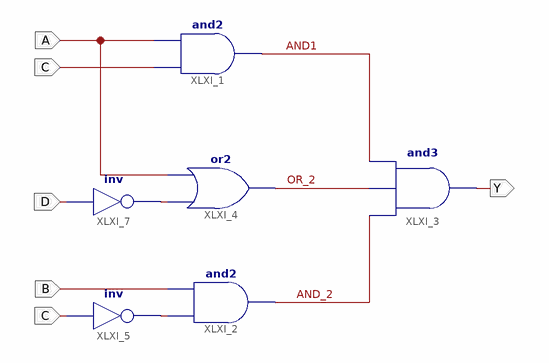
[diagram p0: schematic sheet 1]
// Xilinx ISE schematic scheme.sch (virtex5) as structural Verilog: 6 symbols, 5 ports
module scheme (
  input  A,
  input  C,
  input  B,
  input  D,
  output Y
);

  wire AND1, AND_2, OR_2, XLXN_5, XLXN_15;

  and XLXI_1 (AND1, C, A);
  and XLXI_2 (AND_2, XLXN_5, B);
  and XLXI_3 (Y, AND_2, OR_2, AND1);
  or XLXI_4 (OR_2, XLXN_15, A);
  not XLXI_5 (XLXN_5, C);
  not XLXI_7 (XLXN_15, D);
endmodule
